# Altium schematic sheet Functional_Module_main.SchDoc
size 209 x 297 mm
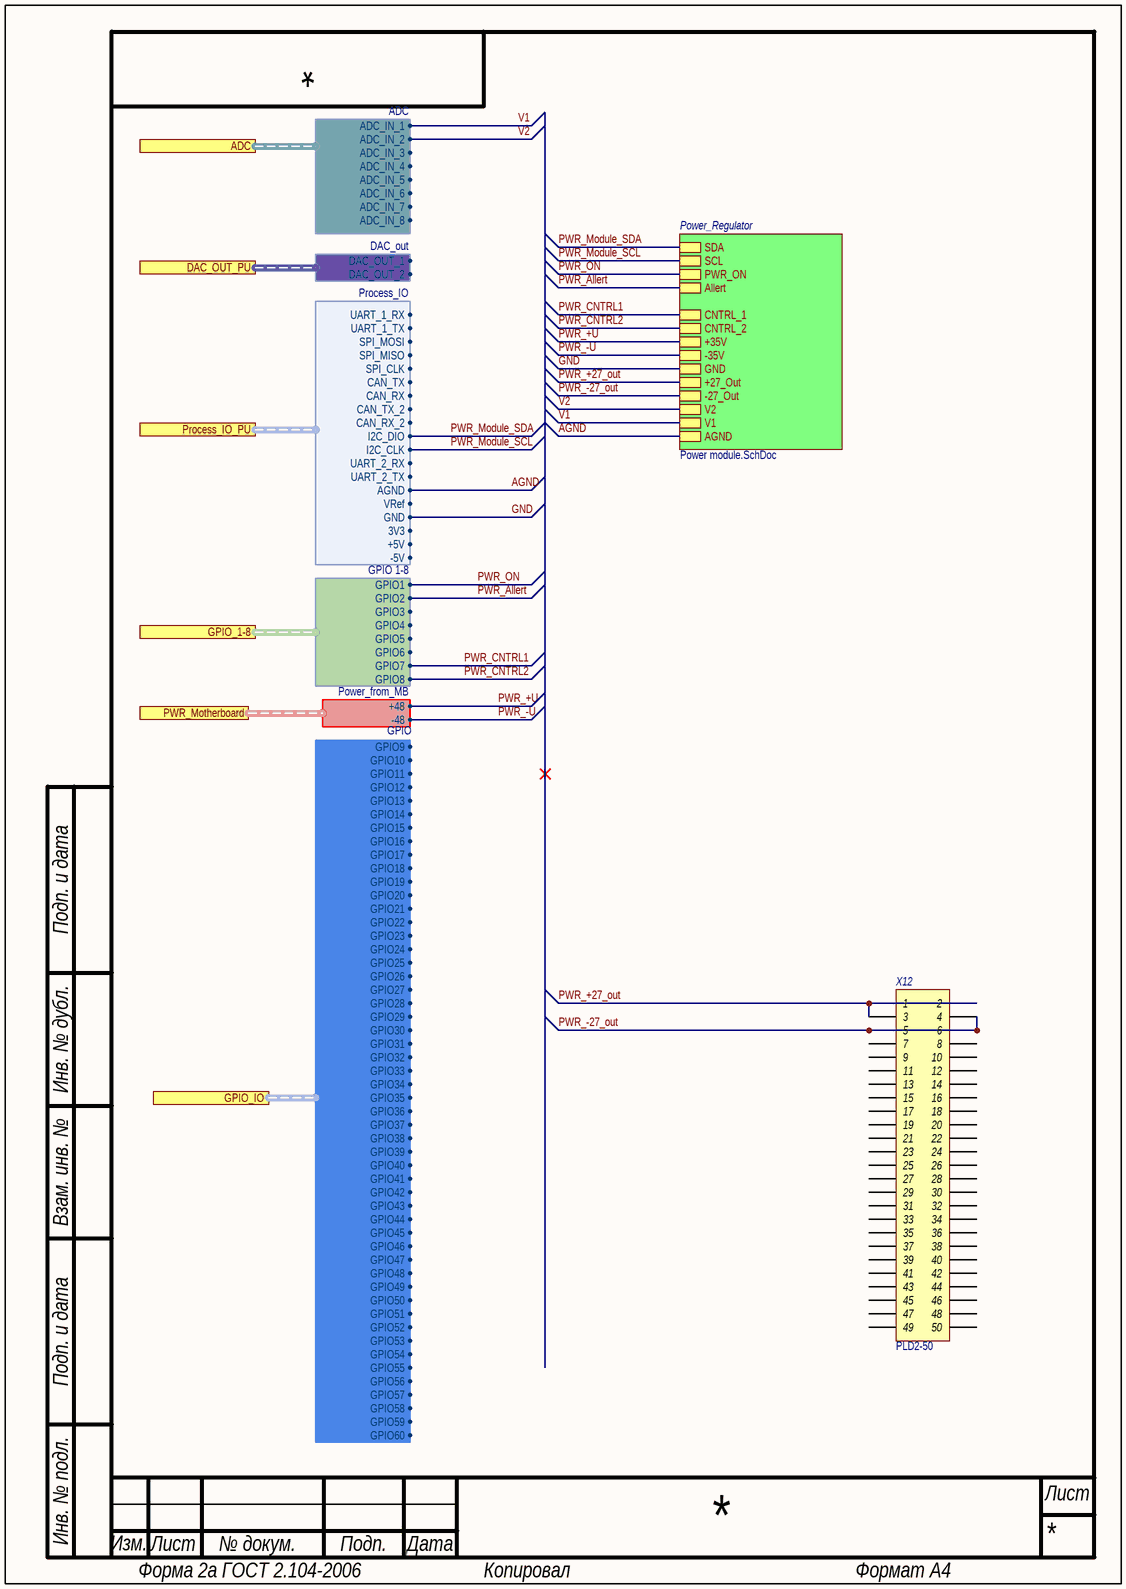
[diagram p0: Functional_Module_main.SchDoc]

## Parts
X12  Header 2X25  [PLD2-50]  (value not drawn)

## Sub-sheets
Power_Regulator = Power module.SchDoc: +35V, CNTRL_1, CNTRL_2, -35V, SDA, PWR_ON, Allert, SCL, -27_Out, +27_Out, GND, V2, V1, AGND

## Ports
ADC (harness ADC), DAC_OUT_PU (harness DAC_out), GPIO_1-8 (harness GPIO 1-8), GPIO_IO (harness GPIO), Process_IO_PU (harness Process_IO), PWR_Motherboard (harness Power_from_MB)

## Harnesses
Process_IO: UART_1_RX, UART_1_TX, SPI_MOSI, SPI_MISO, SPI_CLK, CAN_TX, CAN_RX, I2C_DIO, I2C_CLK, UART_2_RX, UART_2_TX, AGND, VRef, GND, 3V3, +5V, -5V, CAN_TX_2, CAN_RX_2
DAC_out: DAC_OUT_1, DAC_OUT_2
GPIO 1-8: GPIO1, GPIO2, GPIO3, GPIO4, GPIO5, GPIO6, GPIO7, GPIO8
Power_from_MB: -48, +48
ADC: ADC_IN_1, ADC_IN_3, ADC_IN_7, ADC_IN_5, ADC_IN_2, ADC_IN_4, ADC_IN_6, ADC_IN_8
GPIO: GPIO9, GPIO10, GPIO11, GPIO12, GPIO13, GPIO14, GPIO15, GPIO16, GPIO17, GPIO18, GPIO19, GPIO20, GPIO21, GPIO22, GPIO23, GPIO24, GPIO25, GPIO26, GPIO27, GPIO28, GPIO29, GPIO30, GPIO31, GPIO32, GPIO33, GPIO34, GPIO35, GPIO36, GPIO37, GPIO38, GPIO39, GPIO40, GPIO41, GPIO42, GPIO43, GPIO44, GPIO45, GPIO46, GPIO47, GPIO48, GPIO49, GPIO50, GPIO51, GPIO52, GPIO53, GPIO54, GPIO55, GPIO56, GPIO57, GPIO58, GPIO59, GPIO60

## Nets
AGND: sheet Power_Regulator/AGND, port Process_IO_PU.AGND
GND: sheet Power_Regulator/GND, port Process_IO_PU.GND
PWR_+27_out: X12.1 X12.2 X12.3 ; sheet Power_Regulator/+27_Out
PWR_+U: sheet Power_Regulator/+35V, port PWR_Motherboard.+48
PWR_-27_out: X12.4 X12.5 X12.6 ; sheet Power_Regulator/-27_Out
PWR_-U: sheet Power_Regulator/-35V, port PWR_Motherboard.-48
PWR_Allert: sheet Power_Regulator/Allert, port GPIO_1-8.GPIO2
PWR_CNTRL1: sheet Power_Regulator/CNTRL_1, port GPIO_1-8.GPIO7
PWR_CNTRL2: sheet Power_Regulator/CNTRL_2, port GPIO_1-8.GPIO8
PWR_Module_SCL: sheet Power_Regulator/SCL, port Process_IO_PU.I2C_CLK
PWR_Module_SDA: sheet Power_Regulator/SDA, port Process_IO_PU.I2C_DIO
PWR_ON: sheet Power_Regulator/PWR_ON, port GPIO_1-8.GPIO1
V1: sheet Power_Regulator/V1, port ADC.ADC_IN_1
V2: sheet Power_Regulator/V2, port ADC.ADC_IN_2

Not connected (* = marked no-connect by the designer): X12 7 8 9 10 11 12 13 14 15 16 17 18 19 20 21 22 23 24 25 26 27 28 29 30 31 32 33 34 35 36 37 38 39 40 41 42 43 44 45 46 47 48 49 50

## Notes on the sheet
- Подп. и дата
- Инв. № дубл.
- Взам. инв. №
- Инв. № подл.
- Изм.
- Лист
- № докум.
- Подп.
- Дата
- Форма 2а ГОСТ 2.104-2006
- Копировал
- Формат А4

## Library data of the parts
X12 = PLD2-50: Header, 50-Pin, Dual row; Назначение: Header, 20-Pin, Dual row; Потребление, Вт: 0,0; Наименование: PLD2-50